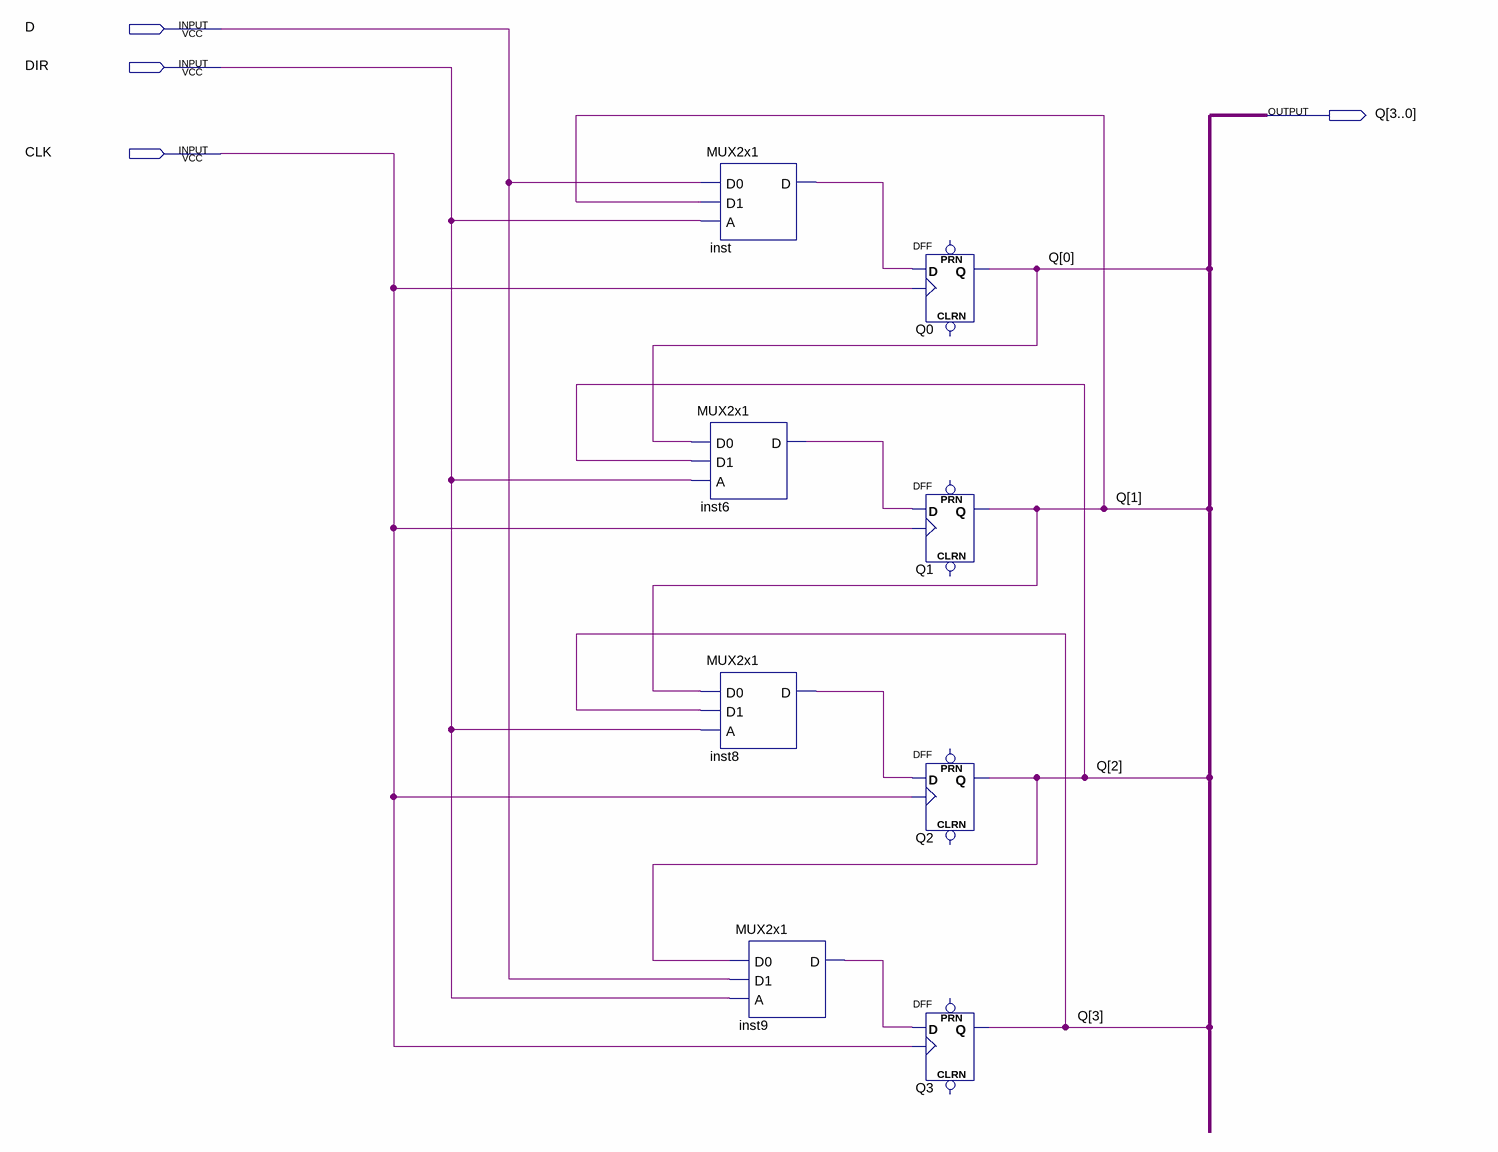
[diagram p0: schematic sheet]
// Quartus schematic Task8.bdf as structural Verilog: 8 symbols, 4 pins
module Task8 (
  input  D,
  input  DIR,
  input  CLK,
  output [3:0] Q
);

  wire inst6_d, inst8_d, inst9_d, inst_d;

  MUX2x1 inst (.D0(D), .D1(Q[1]), .A(DIR), .D(inst_d));
  MUX2x1 inst6 (.D0(Q[0]), .D1(Q[2]), .A(DIR), .D(inst6_d));
  MUX2x1 inst8 (.D0(Q[1]), .D1(Q[3]), .A(DIR), .D(inst8_d));
  MUX2x1 inst9 (.D0(Q[2]), .D1(D), .A(DIR), .D(inst9_d));
  DFF Q0 (.CLK(CLK), .D(inst_d), .Q(Q[0]));  // open: CLRN, PRN
  DFF Q1 (.CLK(CLK), .D(inst6_d), .Q(Q[1]));  // open: CLRN, PRN
  DFF Q2 (.CLK(CLK), .D(inst8_d), .Q(Q[2]));  // open: CLRN, PRN
  DFF Q3 (.CLK(CLK), .D(inst9_d), .Q(Q[3]));  // open: CLRN, PRN
endmodule
